# Altium schematic sheet [05]Power Supply Tracker.SchDoc
size A4; Organization: Altium Limited; Address1: L3, 12a Rodborough Rd; Address2: Frenchs Forest; Address3: NSW; Address4: Australia 2086
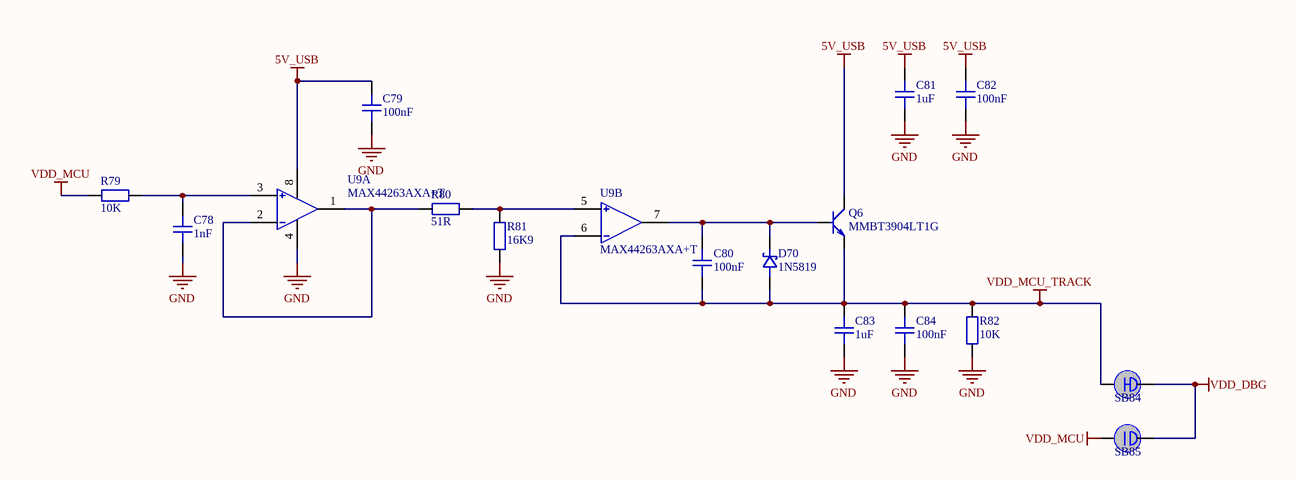
[diagram p0: [05]Power Supply Tracker.SchDoc]

## Parts
C78  1nF  [CAPC1005L]
C79  100nF  [CAPC1005L]
C80  100nF  [CAPC1005L]
C81  1uF  [CAPC1005L]
C82  100nF  [CAPC1005L]
C83  1uF  [CAPC1005L]
C84  100nF  [CAPC1005L]
D70  1N5819  [SOD2512X100L]
Q6  MMBT3904LT1G  [SOT23-3N]
R79  10K  [RESC1005L]
R80  51R  [RESC1005L]
R81  16K9  [RESC1005L]
R82  10K  [RESC1005L]
SB84  SBS  [SBS]  (value not drawn)  (net tie, no BOM)
SB85  SBO  [SBO]  (value not drawn)  (no BOM)
U9  MAX44263AXA+T  [SC-70-8]  (parts A,B of 2)

## Nets
5V_USB: C79.2 C81.2 C82.2 Q6.3 U9.8
GND: C78.1 C79.1 C81.1 C82.1 C83.1 C84.1 R81.1 R82.1 U9.4
VDD_DBG: SB84.2 SB85.2
VDD_MCU: R79.1 SB85.1
VDD_MCU_TRACK: C80.1 C83.2 C84.2 D70.2 Q6.2 R82.2 SB84.1 U9.6(VIN-)
NetC78_2: C78.2 R79.2 U9.3(VIN+)
NetC80_2: C80.2 D70.1 Q6.1 U9.7(OUT)
NetR80_1: R80.1 U9.1(OUT) U9.2(VIN-)
NetR80_2: R80.2 R81.2 U9.5(VIN+)

## Notes on the sheet
- Title
- Size:
- Date:
- A4
- Number:
- Time:
- Revision:
- Sheet
- of
- File:

## Library data of the parts
C78-C84 = CAP_CHP: Surface Mount Unpolarized Capacitor
D70 = SKT_SMD: Surface Mount Diode
Q6 = TRAN_NPN: Surface Mount NPN Transistor
R79-R82 = RES_CHP: Surface Mount Resistor
SB84 = SBS: Short-circuit soldering bridge
SB85 = SBO: Open-circuit soldering bridge
U9 = MAX44263: General Purpose Amplifier 2 Circuit Rail-to-Rail